# EAGLE design schluecki (EAGLE 6.2)
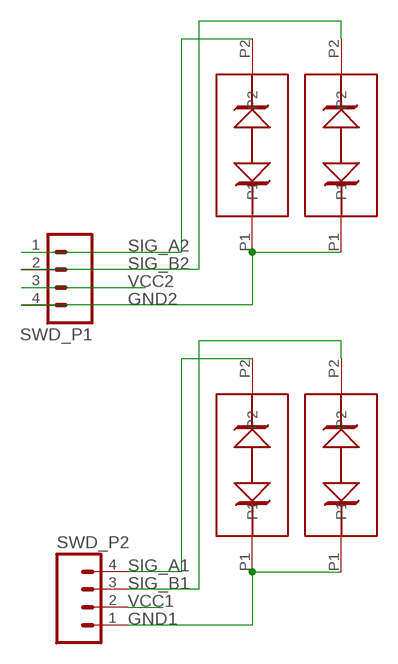
[diagram p0: schematic, sheet 1]

## Parts
SWD_P1  M04  [04P]
SWD_P2  M04  [04P]
U$1  SMB/DO-214AA  [DO-214AA]
U$2  SMB/DO-214AA  [DO-214AA]
U$3  SMB/DO-214AA  [DO-214AA]
U$4  SMB/DO-214AA  [DO-214AA]

## Nets
GND1: SWD_P2.1 U$1.P1 U$2.P1
GND2: SWD_P1.4 U$3.P1 U$4.P1
SIG_A1: SWD_P2.4 U$1.P2
SIG_A2: SWD_P1.1 U$3.P2
SIG_B1: SWD_P2.3 U$2.P2
SIG_B2: SWD_P1.2 U$4.P2
VCC1: SWD_P2.2
VCC2: SWD_P1.3

## Library data of the parts
SWD_P1 SWD_P2 = con-amp-quick:M04: AMP QUICK CONNECTOR; OC_FARNELL: unknown; OC_NEWARK: unknown
U$1-U$4 = P6SMB:SMB/DO-214AA

## Board
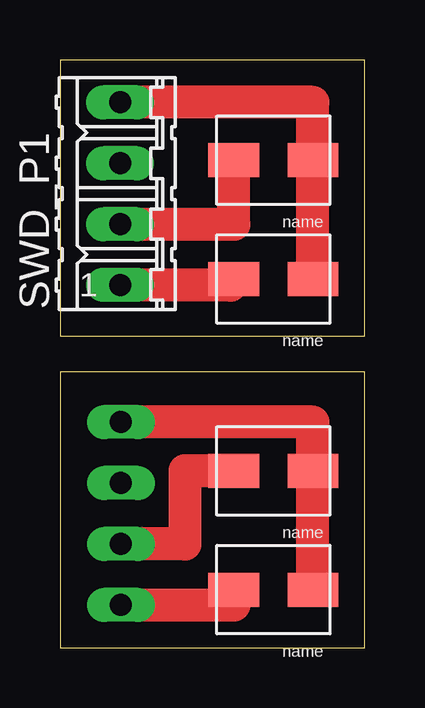
[diagram p1: board, top side]
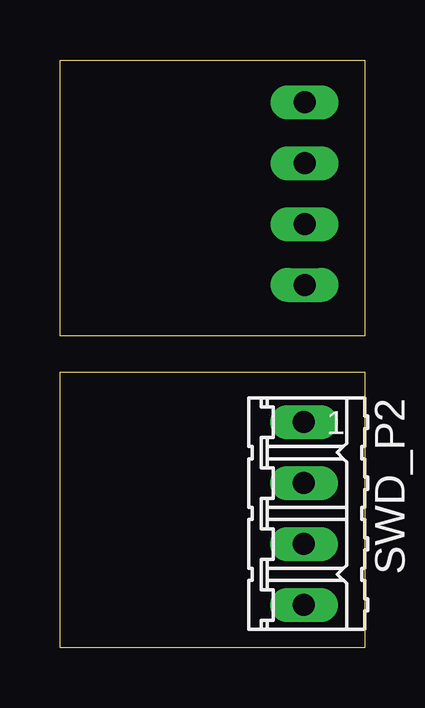
[diagram p2: board, bottom side, seen from below]

Size 12.7 x 24.5 mm. Coordinates in mm from the lower left corner, seen from the top.
Outline: 0,0 12.7,0 12.7,11.5 0,11.5 0,0
Outline: 0,13 12.7,13 12.7,24.5 0,24.5 0,13
Copper layers (1*16): Top 0.035mm / dielectric 1.5mm / Bottom 0.035mm
Design rules: minimum track width 10mil, minimum drill 24mil, track to track 8mil, track to pad 8mil, pad to pad 8mil, via to via 8mil, smd to smd 8mil, copper to edge 40mil, drill to drill 8mil, minimum pad ring 10mil, minimum via ring 8mil, stop-mask expansion 4mil, vias tented up to drill 0mil, thermal gap 10mil

### Footprints (pad centres in the part's own frame; a part is rotated, then mirrored left to right if it is on the bottom)
04P = drill 0.914 long: 1 -3.81,0; 2 -1.27,0; 3 1.27,0; 4 3.81,0
DO-214AA = smd 2.11 x 1.41: P1 -1.65,0; P2 1.65,0

### Placement (x,y rotation side)
SWD_P1  2.51,18.93 90 top
SWD_P2  2.54,5.59 270 bottom
U$1  8.89,2.41 180 top
U$2  8.89,7.37 180 top
U$3  8.89,15.37 180 top
U$4  8.89,20.32 180 top

### Tracks (layer width: path | path; a pad name or v marks a point on that pad's centre or on a via)
GND1
  Top 1.372: U$1.P1 U$2.P1 10.54,9.4 SWD_P2.1
GND2
  Top 1.372: U$3.P1 U$4.P1 10.54,22.74 SWD_P1.4
SIG_A1
  Top 1.372: SWD_P2.4 7.24,1.78 U$1.P2
SIG_A2
  Top 1.372: U$3.P2 7.11,15.37 7.11,15.11 SWD_P1.1
SIG_B1
  Top 1.372: U$2.P2 5.21,7.37 5.21,4.32 SWD_P2.3
SIG_B2
  Top 1.372: SWD_P1.2 7.24,17.66 U$4.P2